# Altium schematic sheet Сборочный.SchDoc
size 594 x 420 mm; Scale: 4:1; Разраб.: Гончаренко А.Ю.; Пров.: Смолин В.А.; Номер листа: 1; Общее количество листов: 1; Наименование изделия 1: Цифровой автомат; Наименование изделия 2: Сборочный чертеж; Нач. отд.: Нач. отд.; Децимальный номер: СФ МЭИ КР ПЭ2-18 11.03.04 03 СБ; Наименование. Строка 2: Автомат; Наименование. Строка 3: Сборочный чертёж; Наименование. Строка 1: Циффровой; Разработал: Гончаренко А.Ю.; Проверил: Смолин В.А.; Утвердил: Рассказа Д.С.; Литера: У; Масштаб: 4:1; Лист. Номер: 1; Лист. Всего: 1
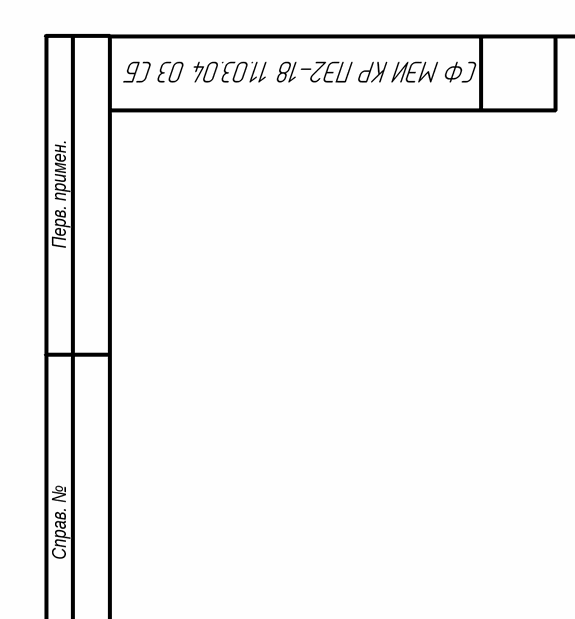
[diagram p0: Сборочный.SchDoc, top left]
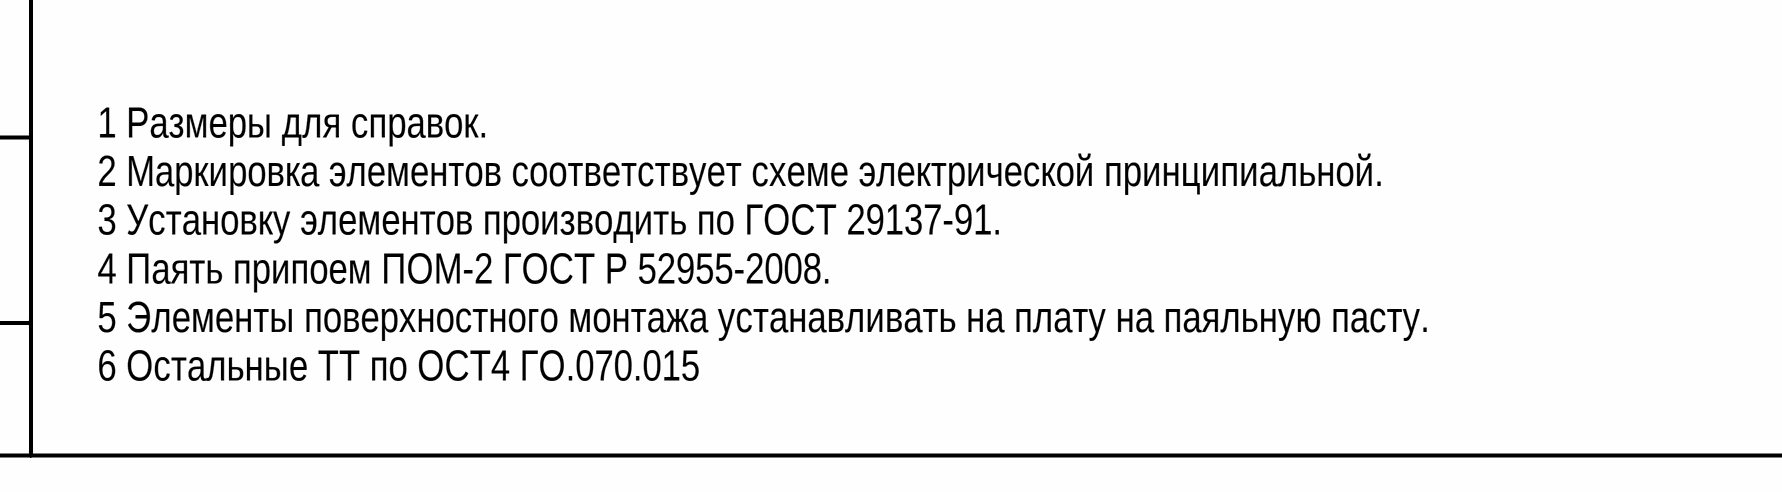
[diagram p1: Сборочный.SchDoc, bottom left]
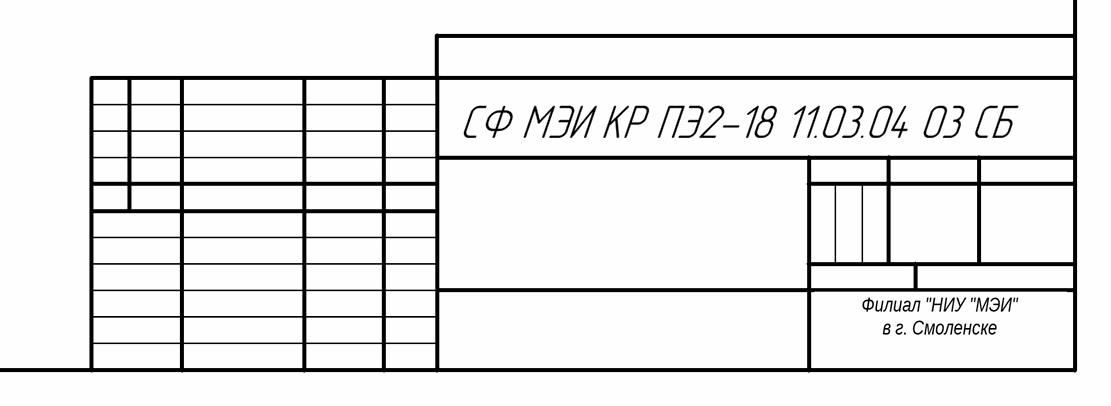
[diagram p2: Сборочный.SchDoc, bottom right]

## Notes on the sheet
- Перв. примен.
- Справ. №
- 1 Размеры для справок.
  2 Маркировка элементов соответствует схеме электрической принципиальной.
  3 Установку элементов производить по ГОСТ 29137-91.
  4 Паять припоем ПОМ-2 ГОСТ Р 52955-2008.
  5 Элементы поверхностного монтажа устанавливать на плату на паяльную пасту.
  6 Остальные ТТ по ОСТ4 ГО.070.015
- Филиал "НИУ "МЭИ"
  в г. Смоленске
  ПЭ2-18
- Разработал. Дата
- Подп. и дата
- Инв. № дубл.
- Взам. инв. №
- Разраб.
- Изм.
- Лист
- № документа
- Подпись
- Дата
- Лит.
- Масса
- Масштаб
- Т. контр.
- Пров.
- Листов
- Инв. № подл.
- Н. контр.
- Утв.
- Копировал
- Формат A2